# Altium schematic sheet Connector_3.SchDoc
size A2; Date: Date; CompanyName: HESSO; Engineer: Name; Address1: Route du Rawyl 47; Address2: 1950 Sion; Address3: Switzerland; DocumentNumber: 2; SheetNumber: 2; SheetTotal: 3; ProjectName: Project Name
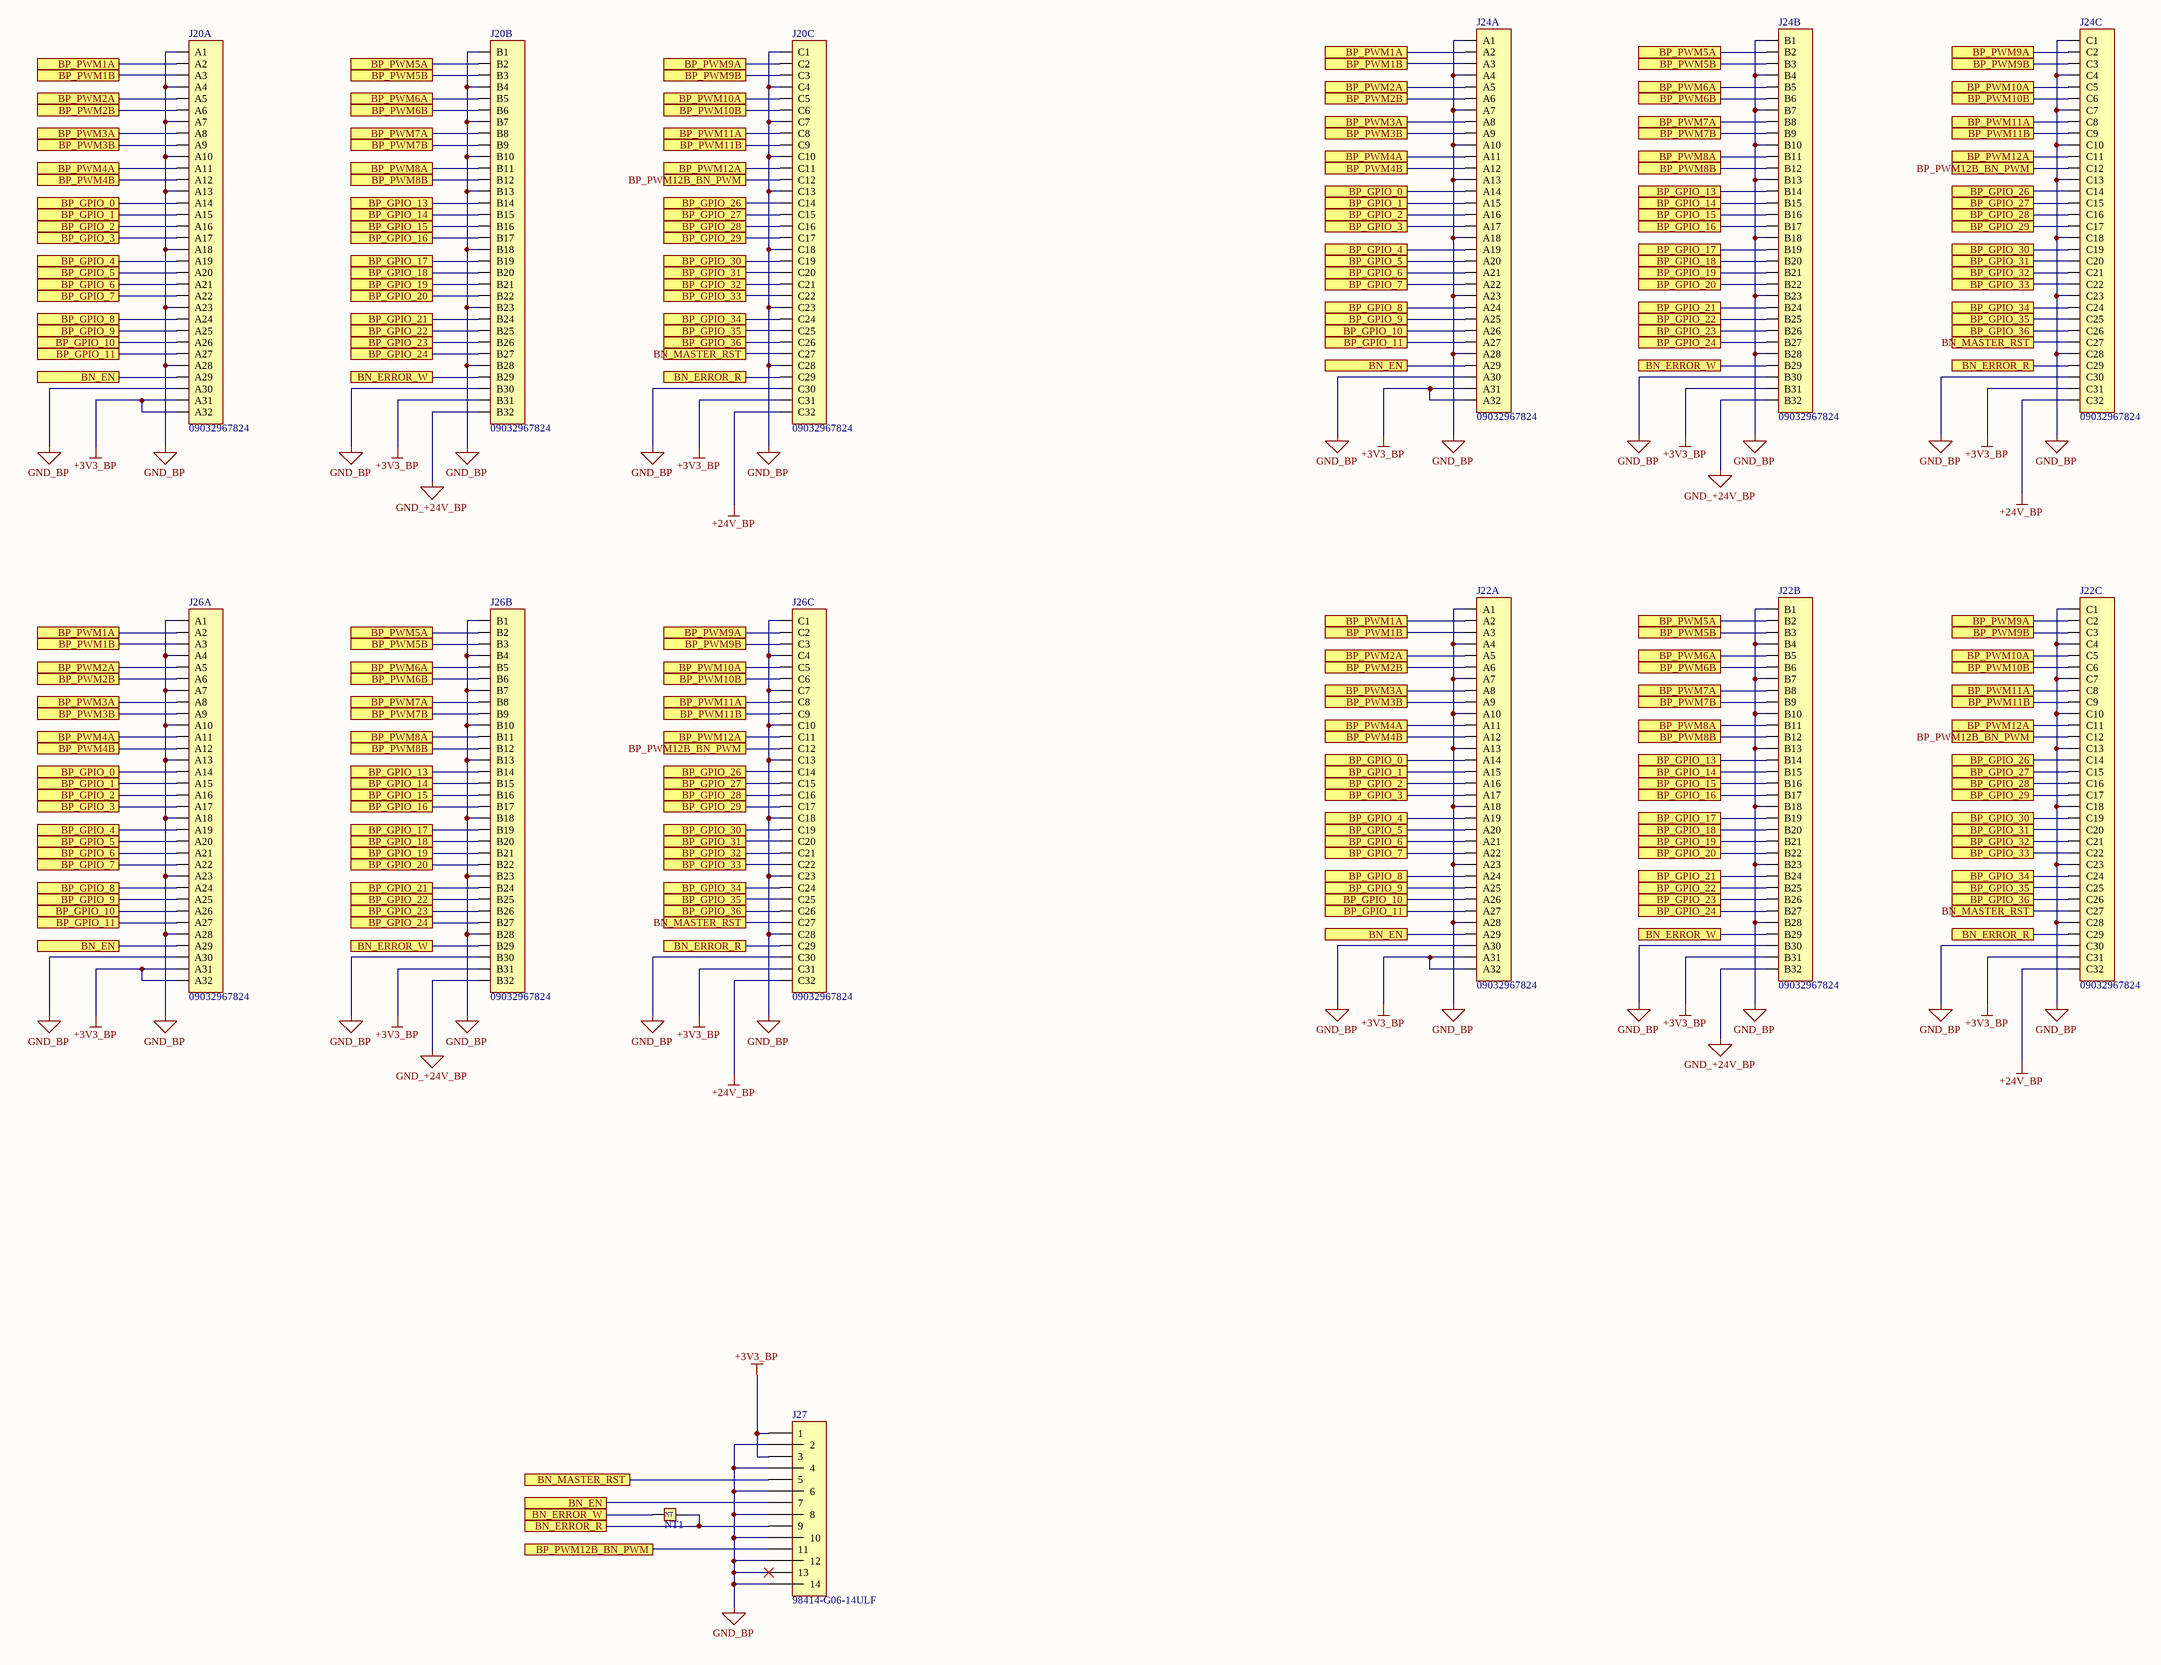
[diagram p0: Connector_3.SchDoc]

## Parts
J20  09032967824  [DIN41612 FEM 3x32 ABC Straight]  (parts A,B,C of 3)
J22  09032967824  [DIN41612 FEM 3x32 ABC Straight]  (parts A,B,C of 3)
J24  09032967824  [DIN41612 FEM 3x32 ABC Straight]  (parts A,B,C of 3)
J26  09032967824  [DIN41612 FEM 3x32 ABC Straight]  (parts A,B,C of 3)
J27  98414-G06-14ULF  [FlatCable2x7 2MM Straight TH FCI 98414-G06-14ULF]
NT1  Net Tie  [NET TIE 1005]  (value not drawn)  (net tie, no BOM)

## Ports
BN_EN, BN_ERROR_R, BN_ERROR_W, BN_MASTER_RST, BP_GPIO_0, BP_GPIO_1, BP_GPIO_2, BP_GPIO_3, BP_GPIO_4, BP_GPIO_5, BP_GPIO_6, BP_GPIO_7, BP_GPIO_8, BP_GPIO_9, BP_GPIO_10, BP_GPIO_11, BP_GPIO_13, BP_GPIO_14, BP_GPIO_15, BP_GPIO_16, BP_GPIO_17, BP_GPIO_18, BP_GPIO_19, BP_GPIO_20, BP_GPIO_21, BP_GPIO_22, BP_GPIO_23, BP_GPIO_24, BP_GPIO_26, BP_GPIO_27, BP_GPIO_28, BP_GPIO_29, BP_GPIO_30, BP_GPIO_31, BP_GPIO_32, BP_GPIO_33, BP_GPIO_34, BP_GPIO_35, BP_GPIO_36, BP_PWM1A, BP_PWM1B, BP_PWM2A, BP_PWM2B, BP_PWM3A, BP_PWM3B, BP_PWM4A, BP_PWM4B, BP_PWM5A, BP_PWM5B, BP_PWM6A, BP_PWM6B, BP_PWM7A, BP_PWM7B, BP_PWM8A, BP_PWM8B, BP_PWM9A, BP_PWM9B, BP_PWM10A, BP_PWM10B, BP_PWM11A, BP_PWM11B, BP_PWM12A, BP_PWM12B_BN_PWM

## Nets
+3V3_BP: J20.A31 J20.A32 J20.B31 J20.C31 J22.A31 J22.A32 J22.B31 J22.C31 J24.A31 J24.A32 J24.B31 J24.C31 J26.A31 J26.A32 J26.B31 J26.C31 J27.1 J27.3
+24V_BP: J20.C32 J22.C32 J24.C32 J26.C32
GND_+24V_BP: J20.B32 J22.B32 J24.B32 J26.B32
GND_BP: J20.A1 J20.A4 J20.A7 J20.A10 J20.A13 J20.A18 J20.A23 J20.A28 J20.A30 J20.B1 J20.B4 J20.B7 J20.B10 J20.B13 J20.B18 J20.B23 J20.B28 J20.B30 J20.C1 J20.C4 J20.C7 J20.C10 J20.C13 J20.C18 J20.C23 J20.C28 J20.C30 J22.A1 J22.A4 J22.A7 J22.A10 J22.A13 J22.A18 J22.A23 J22.A28 J22.A30 J22.B1 J22.B4 J22.B7 J22.B10 J22.B13 J22.B18 J22.B23 J22.B28 J22.B30 J22.C1 J22.C4 J22.C7 J22.C10 J22.C13 J22.C18 J22.C23 J22.C28 J22.C30 J24.A1 J24.A4 J24.A7 J24.A10 J24.A13 J24.A18 J24.A23 J24.A28 J24.A30 J24.B1 J24.B4 J24.B7 J24.B10 J24.B13 J24.B18 J24.B23 J24.B28 J24.B30 J24.C1 J24.C4 J24.C7 J24.C10 J24.C13 J24.C18 J24.C23 J24.C28 J24.C30 J26.A1 J26.A4 J26.A7 J26.A10 J26.A13 J26.A18 J26.A23 J26.A28 J26.A30 J26.B1 J26.B4 J26.B7 J26.B10 J26.B13 J26.B18 J26.B23 J26.B28 J26.B30 J26.C1 J26.C4 J26.C7 J26.C10 J26.C13 J26.C18 J26.C23 J26.C28 J26.C30 J27.2 J27.4 J27.6 J27.8 J27.10 J27.12 J27.13 J27.14
BN_EN: J20.A29 J22.A29 J24.A29 J26.A29 J27.7 ; port BN_EN
BN_ERROR_R: J20.C29 J22.C29 J24.C29 J26.C29 J27.9 NT1.2 ; port BN_ERROR_R
BN_ERROR_W: J20.B29 J22.B29 J24.B29 J26.B29 NT1.1 ; port BN_ERROR_W
BN_MASTER_RST: J20.C27 J22.C27 J24.C27 J26.C27 J27.5 ; port BN_MASTER_RST
BP_GPIO_0: J20.A14 J22.A14 J24.A14 J26.A14 ; port BP_GPIO_0
BP_GPIO_1: J20.A15 J22.A15 J24.A15 J26.A15 ; port BP_GPIO_1
BP_GPIO_2: J20.A16 J22.A16 J24.A16 J26.A16 ; port BP_GPIO_2
BP_GPIO_3: J20.A17 J22.A17 J24.A17 J26.A17 ; port BP_GPIO_3
BP_GPIO_4: J20.A19 J22.A19 J24.A19 J26.A19 ; port BP_GPIO_4
BP_GPIO_5: J20.A20 J22.A20 J24.A20 J26.A20 ; port BP_GPIO_5
BP_GPIO_6: J20.A21 J22.A21 J24.A21 J26.A21 ; port BP_GPIO_6
BP_GPIO_7: J20.A22 J22.A22 J24.A22 J26.A22 ; port BP_GPIO_7
BP_GPIO_8: J20.A24 J22.A24 J24.A24 J26.A24 ; port BP_GPIO_8
BP_GPIO_9: J20.A25 J22.A25 J24.A25 J26.A25 ; port BP_GPIO_9
BP_GPIO_10: J20.A26 J22.A26 J24.A26 J26.A26 ; port BP_GPIO_10
BP_GPIO_11: J20.A27 J22.A27 J24.A27 J26.A27 ; port BP_GPIO_11
BP_GPIO_13: J20.B14 J22.B14 J24.B14 J26.B14 ; port BP_GPIO_13
BP_GPIO_14: J20.B15 J22.B15 J24.B15 J26.B15 ; port BP_GPIO_14
BP_GPIO_15: J20.B16 J22.B16 J24.B16 J26.B16 ; port BP_GPIO_15
BP_GPIO_16: J20.B17 J22.B17 J24.B17 J26.B17 ; port BP_GPIO_16
BP_GPIO_17: J20.B19 J22.B19 J24.B19 J26.B19 ; port BP_GPIO_17
BP_GPIO_18: J20.B20 J22.B20 J24.B20 J26.B20 ; port BP_GPIO_18
BP_GPIO_19: J20.B21 J22.B21 J24.B21 J26.B21 ; port BP_GPIO_19
BP_GPIO_20: J20.B22 J22.B22 J24.B22 J26.B22 ; port BP_GPIO_20
BP_GPIO_21: J20.B24 J22.B24 J24.B24 J26.B24 ; port BP_GPIO_21
BP_GPIO_22: J20.B25 J22.B25 J24.B25 J26.B25 ; port BP_GPIO_22
BP_GPIO_23: J20.B26 J22.B26 J24.B26 J26.B26 ; port BP_GPIO_23
BP_GPIO_24: J20.B27 J22.B27 J24.B27 J26.B27 ; port BP_GPIO_24
BP_GPIO_26: J20.C14 J22.C14 J24.C14 J26.C14 ; port BP_GPIO_26
BP_GPIO_27: J20.C15 J22.C15 J24.C15 J26.C15 ; port BP_GPIO_27
BP_GPIO_28: J20.C16 J22.C16 J24.C16 J26.C16 ; port BP_GPIO_28
BP_GPIO_29: J20.C17 J22.C17 J24.C17 J26.C17 ; port BP_GPIO_29
BP_GPIO_30: J20.C19 J22.C19 J24.C19 J26.C19 ; port BP_GPIO_30
BP_GPIO_31: J20.C20 J22.C20 J24.C20 J26.C20 ; port BP_GPIO_31
BP_GPIO_32: J20.C21 J22.C21 J24.C21 J26.C21 ; port BP_GPIO_32
BP_GPIO_33: J20.C22 J22.C22 J24.C22 J26.C22 ; port BP_GPIO_33
BP_GPIO_34: J20.C24 J22.C24 J24.C24 J26.C24 ; port BP_GPIO_34
BP_GPIO_35: J20.C25 J22.C25 J24.C25 J26.C25 ; port BP_GPIO_35
BP_GPIO_36: J20.C26 J22.C26 J24.C26 J26.C26 ; port BP_GPIO_36
BP_PWM1A: J20.A2 J22.A2 J24.A2 J26.A2 ; port BP_PWM1A
BP_PWM1B: J20.A3 J22.A3 J24.A3 J26.A3 ; port BP_PWM1B
BP_PWM2A: J20.A5 J22.A5 J24.A5 J26.A5 ; port BP_PWM2A
BP_PWM2B: J20.A6 J22.A6 J24.A6 J26.A6 ; port BP_PWM2B
BP_PWM3A: J20.A8 J22.A8 J24.A8 J26.A8 ; port BP_PWM3A
BP_PWM3B: J20.A9 J22.A9 J24.A9 J26.A9 ; port BP_PWM3B
BP_PWM4A: J20.A11 J22.A11 J24.A11 J26.A11 ; port BP_PWM4A
BP_PWM4B: J20.A12 J22.A12 J24.A12 J26.A12 ; port BP_PWM4B
BP_PWM5A: J20.B2 J22.B2 J24.B2 J26.B2 ; port BP_PWM5A
BP_PWM5B: J20.B3 J22.B3 J24.B3 J26.B3 ; port BP_PWM5B
BP_PWM6A: J20.B5 J22.B5 J24.B5 J26.B5 ; port BP_PWM6A
BP_PWM6B: J20.B6 J22.B6 J24.B6 J26.B6 ; port BP_PWM6B
BP_PWM7A: J20.B8 J22.B8 J24.B8 J26.B8 ; port BP_PWM7A
BP_PWM7B: J20.B9 J22.B9 J24.B9 J26.B9 ; port BP_PWM7B
BP_PWM8A: J20.B11 J22.B11 J24.B11 J26.B11 ; port BP_PWM8A
BP_PWM8B: J20.B12 J22.B12 J24.B12 J26.B12 ; port BP_PWM8B
BP_PWM9A: J20.C2 J22.C2 J24.C2 J26.C2 ; port BP_PWM9A
BP_PWM9B: J20.C3 J22.C3 J24.C3 J26.C3 ; port BP_PWM9B
BP_PWM10A: J20.C5 J22.C5 J24.C5 J26.C5 ; port BP_PWM10A
BP_PWM10B: J20.C6 J22.C6 J24.C6 J26.C6 ; port BP_PWM10B
BP_PWM11A: J20.C8 J22.C8 J24.C8 J26.C8 ; port BP_PWM11A
BP_PWM11B: J20.C9 J22.C9 J24.C9 J26.C9 ; port BP_PWM11B
BP_PWM12A: J20.C11 J22.C11 J24.C11 J26.C11 ; port BP_PWM12A
BP_PWM12B_BN_PWM: J20.C12 J22.C12 J24.C12 J26.C12 J27.11 ; port BP_PWM12B_BN_PWM

## Notes on the sheet
- Date :
- Revision :
- Sheet
- of
- Design by :
- (in symbol Net Tie) NT

## Library data of the parts
J20 J22 J24 J26 = DIN41612 FEM 3X32 STRAIGHT: DIN41612 FEM 3X32 ABC STRAIGHT; Manufacturer: Harting; Value: 09032967824; Mouser No.: 617-09032967824
J27 = FlatCable2x7: Manufacturer: Amphenol FCI; Mouser No.: 649-98414-G06-14ULF; Value: 98414-G06-14ULF
NT1 = Net Tie: Connection for 2 different NETNAME